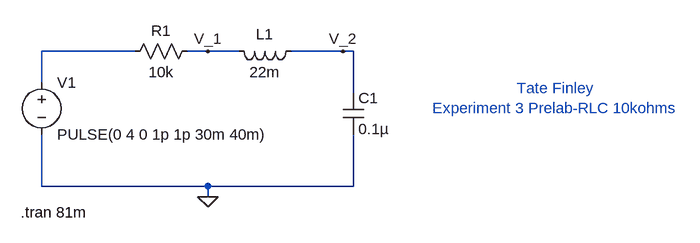
[diagram p0: schematic ECE3060_Experiment3_10Kohm_series.asc]
ECE3060_Experiment3_10Kohm_series.asc, the LTspice schematic file:
Version 4
SHEET 1 880 680
WIRE -80 80 -224 80
WIRE 32 80 0 80
WIRE 80 80 32 80
WIRE 240 80 160 80
WIRE 256 80 240 80
WIRE -224 128 -224 80
WIRE 256 144 256 80
WIRE -224 288 -224 208
WIRE 32 288 -224 288
WIRE 256 288 256 208
WIRE 256 288 32 288
WIRE 32 304 32 288
FLAG 32 304 0
FLAG 32 80 V_1
FLAG 240 80 V_2
SYMBOL voltage -224 112 R0
WINDOW 123 0 0 Left 0
WINDOW 39 0 0 Left 0
SYMATTR InstName V1
SYMATTR Value PULSE(0 4 0 1p 1p 30m 40m)
SYMBOL res 16 64 R90
WINDOW 0 0 56 VBottom 2
WINDOW 3 32 56 VTop 2
SYMATTR InstName R1
SYMATTR Value 10k
SYMBOL ind 176 64 R90
WINDOW 0 5 56 VBottom 2
WINDOW 3 32 56 VTop 2
SYMATTR InstName L1
SYMATTR Value 22m
SYMBOL cap 240 144 R0
SYMATTR InstName C1
SYMATTR Value 0.1µ
TEXT 568 152 Center 2 ;Tate Finley\nExperiment 3 Prelab-RLC 10kohms
TEXT -256 328 Left 2 !.tran 81m

The netlist it stands for:
* ECE3060_Experiment3_10Kohm_series.asc
V1 N001 0 PULSE(0 4 0 1p 1p 30m 40m)
R1 V_1 N001 10k
L1 V_2 V_1 22m
C1 V_2 0 0.1µ
* Tate Finley
* Experiment 3 Prelab-RLC 10kohms
.tran 81m
.backanno
.end